# EAGLE design untitled (EAGLE 6.6.0)
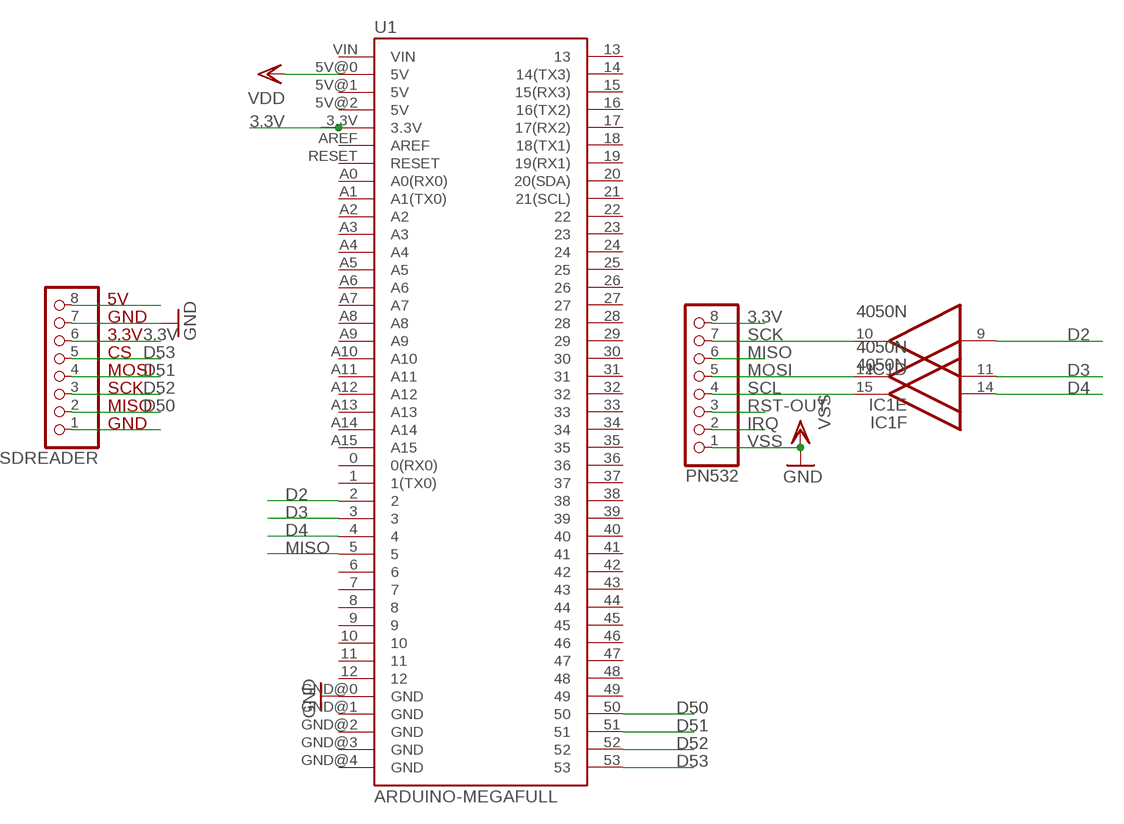
[diagram p0: schematic, sheet 1]

## Parts
IC1  4050N  [DIL16]
PN532  PINHD-1X8BIG  [1X08-BIG]
SDREADER  PINHD-1X8BIG  [1X08-BIG]
U1  ARDUINO-MEGAFULL  [ARDUINO_MEGA]

## Nets
3.3V: PN532.8 SDREADER.6 U1.3.3V
D2: IC1.9(D:I) U1.2
D3: IC1.11(E:I) U1.3
D4: IC1.14(F:I) U1.4
D50: SDREADER.2 U1.50
D51: SDREADER.4 U1.51
D52: SDREADER.3 U1.52
D53: SDREADER.5 U1.53
GND: SDREADER.7 U1.GND@0(GND)
IRQ: PN532.2
MISO: PN532.6 U1.5
MOSI: IC1.12(E:O) PN532.5
N$1: SDREADER.1
N$9: SDREADER.8
RST-OUT: PN532.3
SCK: IC1.10(D:O) PN532.7
SCL: IC1.15(F:O) PN532.4
VDD: U1.5V@0(5V)
VSS: PN532.1 ; supply symbol labelled GND
Unconnected: IC1.2(A:O) IC1.3(A:I) IC1.4(B:O) IC1.5(B:I) IC1.6(C:O) IC1.7(C:I) U1.0(0(RX0)) U1.1(1(TX0)) U1.5V@1(5V) U1.5V@2(5V) U1.6 U1.7 U1.8 U1.9 U1.10 U1.11 U1.12 U1.13 U1.14(14(TX3)) U1.15(15(RX3)) U1.16(16(TX2)) U1.17(17(RX2)) U1.18(18(TX1)) U1.19(19(RX1)) U1.20(20(SDA)) U1.21(21(SCL)) U1.22 U1.23 U1.24 U1.25 U1.26 U1.27 U1.28 U1.29 U1.30 U1.31 U1.32 U1.33 U1.34 U1.35 U1.36 U1.37 U1.38 U1.39 U1.40 U1.41 U1.42 U1.43 U1.44 U1.45 U1.46 U1.47 U1.48 U1.49 U1.A0(A0(RX0)) U1.A1(A1(TX0)) U1.A2 U1.A3 U1.A4 U1.A5 U1.A6 U1.A7 U1.A8 U1.A9 U1.A10 U1.A11 U1.A12 U1.A13 U1.A14 U1.A15 U1.AREF U1.GND@1(GND) U1.GND@2(GND) U1.GND@3(GND) U1.GND@4(GND) U1.RESET U1.VIN

## Notes on the sheet
- 5V
- GND
- 3.3V
- CS
- MOSI
- SCK
- MISO
- GND

## Power pins joined to a net without a drawn wire
VDD: IC1.1(P:VDD)
VSS: IC1.8(P:VSS)

## Library data of the parts
IC1 = 40xx:4050: Hex non-inverting BUFFER
PN532 SDREADER = adafruit:PINHD-1X8: PIN HEADER
U1 = ardiuno:ARDUINO-MEGA: Arduino Mega board footprint

## Board
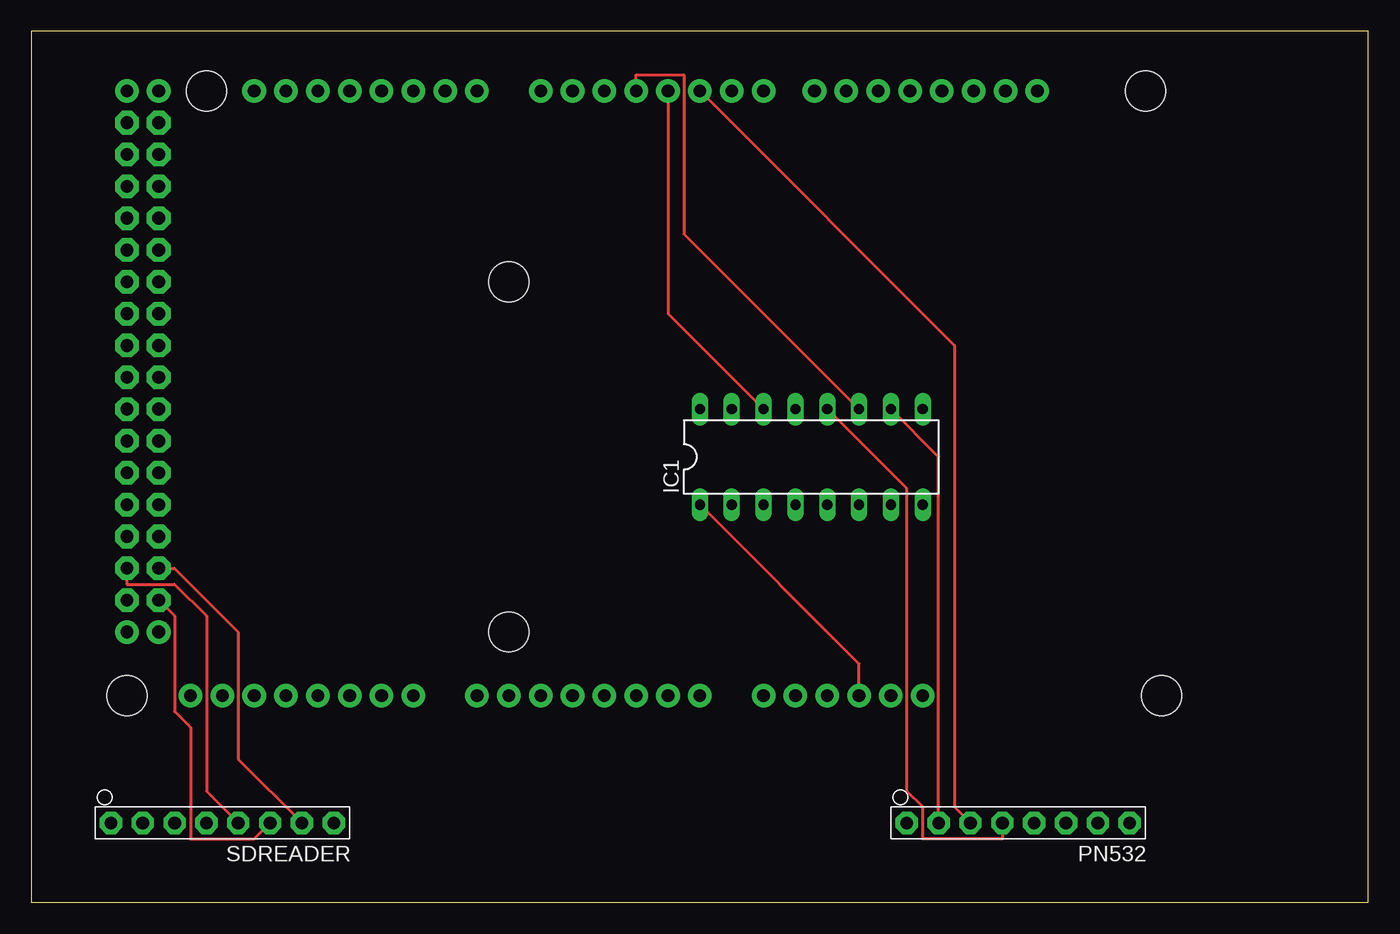
[diagram p1: board, top side]
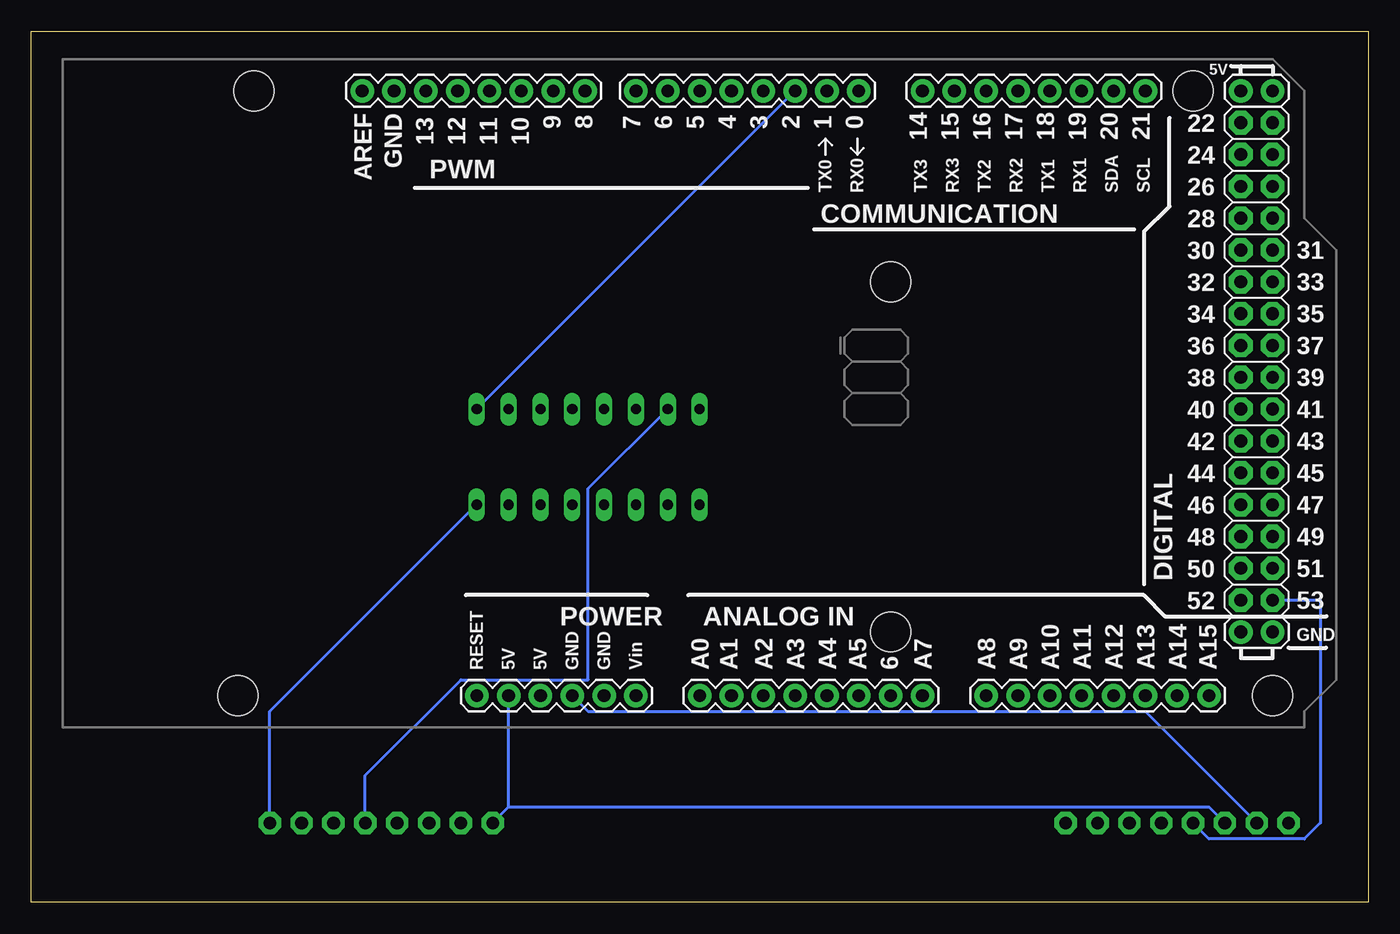
[diagram p2: board, bottom side, seen from below]

Size 106.66 x 69.52 mm. Coordinates in mm from the lower left corner, seen from the top.
Outline: 0,0 106.66,0 106.66,69.52 0,69.52 0,0
Copper layers (1*16): Top 0.035mm / dielectric 1.5mm / Bottom 0.035mm
Design rules "default": minimum track width 10mil, minimum drill 24mil, track to track 8mil, track to pad 8mil, pad to pad 8mil, via to via 8mil, smd to smd 8mil, copper to edge 40mil, drill to drill 8mil, minimum pad ring 10mil, minimum via ring 8mil, stop-mask expansion 4mil, vias tented up to drill 0mil, thermal gap 10mil

### Footprints (pad centres in the part's own frame; a part is rotated, then mirrored left to right if it is on the bottom)
DIL16 = drill 0.813 long: 1 -8.89,-3.81; 2 -6.35,-3.81; 3 -3.81,-3.81; 4 -1.27,-3.81; 5 1.27,-3.81; 6 3.81,-3.81; 7 6.35,-3.81; 8 8.89,-3.81; 9 8.89,3.81; 10 6.35,3.81; 11 3.81,3.81; 12 1.27,3.81; 13 -1.27,3.81; 14 -3.81,3.81; 15 -6.35,3.81; 16 -8.89,3.81
1X08-BIG = drill 1.016 pad 1.778 octagon: 1 -8.89,0; 2 -6.35,0; 3 -3.81,0; 4 -1.27,0; 5 1.27,0; 6 3.81,0; 7 6.35,0; 8 8.89,0
ARDUINO_MEGA = drill 1.016 pad 1.88: 0 63.5,50.8; 1 60.96,50.8; 2 58.42,50.8; 3 55.88,50.8; 3.3V 35.56,2.54; 4 53.34,50.8; 5 50.8,50.8; 5V@0 38.1,2.54; 5V@1 93.98,50.8; 5V@2 96.52,50.8; 6 48.26,50.8; 7 45.72,50.8; 8 41.656,50.8; 9 39.116,50.8; 10 36.576,50.8; 11 34.036,50.8; 12 31.496,50.8; 13 28.956,50.8; 14 68.58,50.8; 15 71.12,50.8; 16 73.66,50.8; 17 76.2,50.8; 18 78.74,50.8; 19 81.28,50.8; 20 83.82,50.8; 21 86.36,50.8; A0 50.8,2.54; A1 53.34,2.54; A2 55.88,2.54; A3 58.42,2.54; A4 60.96,2.54; A5 63.5,2.54; A6 66.04,2.54; A7 68.58,2.54; A8 73.66,2.54; A9 76.2,2.54; A10 78.74,2.54; A11 81.28,2.54; A12 83.82,2.54; A13 86.36,2.54; A14 88.9,2.54; A15 91.44,2.54; AREF 23.876,50.8; GND@0 40.64,2.54; GND@1 43.18,2.54; GND@2 93.98,7.62; GND@3 96.52,7.62; GND@4 26.416,50.8; RESET 33.02,2.54; VIN 45.72,2.54 | drill 1.016 pad 1.88 octagon: 22 93.98,48.26; 23 96.52,48.26; 24 93.98,45.72; 25 96.52,45.72; 26 93.98,43.18; 27 96.52,43.18; 28 93.98,40.64; 29 96.52,40.64; 30 93.98,38.1; 31 96.52,38.1; 32 93.98,35.56; 33 96.52,35.56; 34 93.98,33.02; 35 96.52,33.02; 36 93.98,30.48; 37 96.52,30.48; 38 93.98,27.94; 39 96.52,27.94; 40 93.98,25.4; 41 96.52,25.4; 42 93.98,22.86; 43 96.52,22.86; 44 93.98,20.32; 45 96.52,20.32; 46 93.98,17.78; 47 96.52,17.78; 48 93.98,15.24; 49 96.52,15.24; 50 93.98,12.7; 51 96.52,12.7; 52 93.98,10.16; 53 96.52,10.16 | hole 3.2: 15.24,50.8; 13.97,2.54; 66.04,35.56; 66.04,7.62; 90.17,50.8; 96.52,2.54

### Placement (x,y rotation side)
IC1  62.23,35.56 0 top
PN532  78.74,6.35 180 top
SDREADER  15.24,6.35 180 top
U1  104.14,13.97 0 bottom

### Tracks (layer width: path | path; a pad name or v marks a point on that pad's centre or on a via)
3.3V
  Bottom 0.254: SDREADER.6 12.7,7.62 68.58,7.62 | PN532.8 68.58,7.62 | 68.58,7.62 U1.3.3V
D2
  Bottom 0.254: U1.2 IC1.9
D3
  Top 0.254: IC1.11 52.07,53.34 52.07,66.04 48.26,66.04 U1.3
D4
  Top 0.254: IC1.14 50.8,46.99 U1.4
D50
  Top 0.254: SDREADER.2 16.51,11.43 16.51,21.59 11.43,26.67 U1.50
D51
  Top 0.254: SDREADER.4 13.97,8.89 13.97,22.86 11.43,25.4 7.62,25.4 U1.51
D52
  Top 0.254: SDREADER.3 17.78,5.08 12.7,5.08 12.7,13.97 11.43,15.24 11.43,22.86 U1.52
D53
  Bottom 0.254: SDREADER.5 12.7,5.08 5.08,5.08 3.81,6.35 3.81,24.13 U1.53
GND
  Bottom 0.254: SDREADER.7 17.78,15.24 62.23,15.24 U1.GND@0
MISO
  Top 0.254: PN532.6 73.66,7.62 73.66,44.45 U1.5
MOSI
  Top 0.254: IC1.12 69.85,33.02 69.85,8.89 71.12,7.62 71.12,5.08 77.47,5.08 PN532.5
SCK
  Top 0.254: IC1.10 72.39,35.56 PN532.7
SCL
  Bottom 0.254: IC1.15 62.23,33.02 62.23,17.78 72.39,17.78 80.01,10.16 PN532.4
VDD
  Top 0.254: IC1.1 66.04,19.05 U1.5V@0
VSS
  Bottom 0.254: IC1.8 87.63,15.24 PN532.1